# EAGLE design 2020-02-LPD3806-orig (EAGLE 9.5.1)
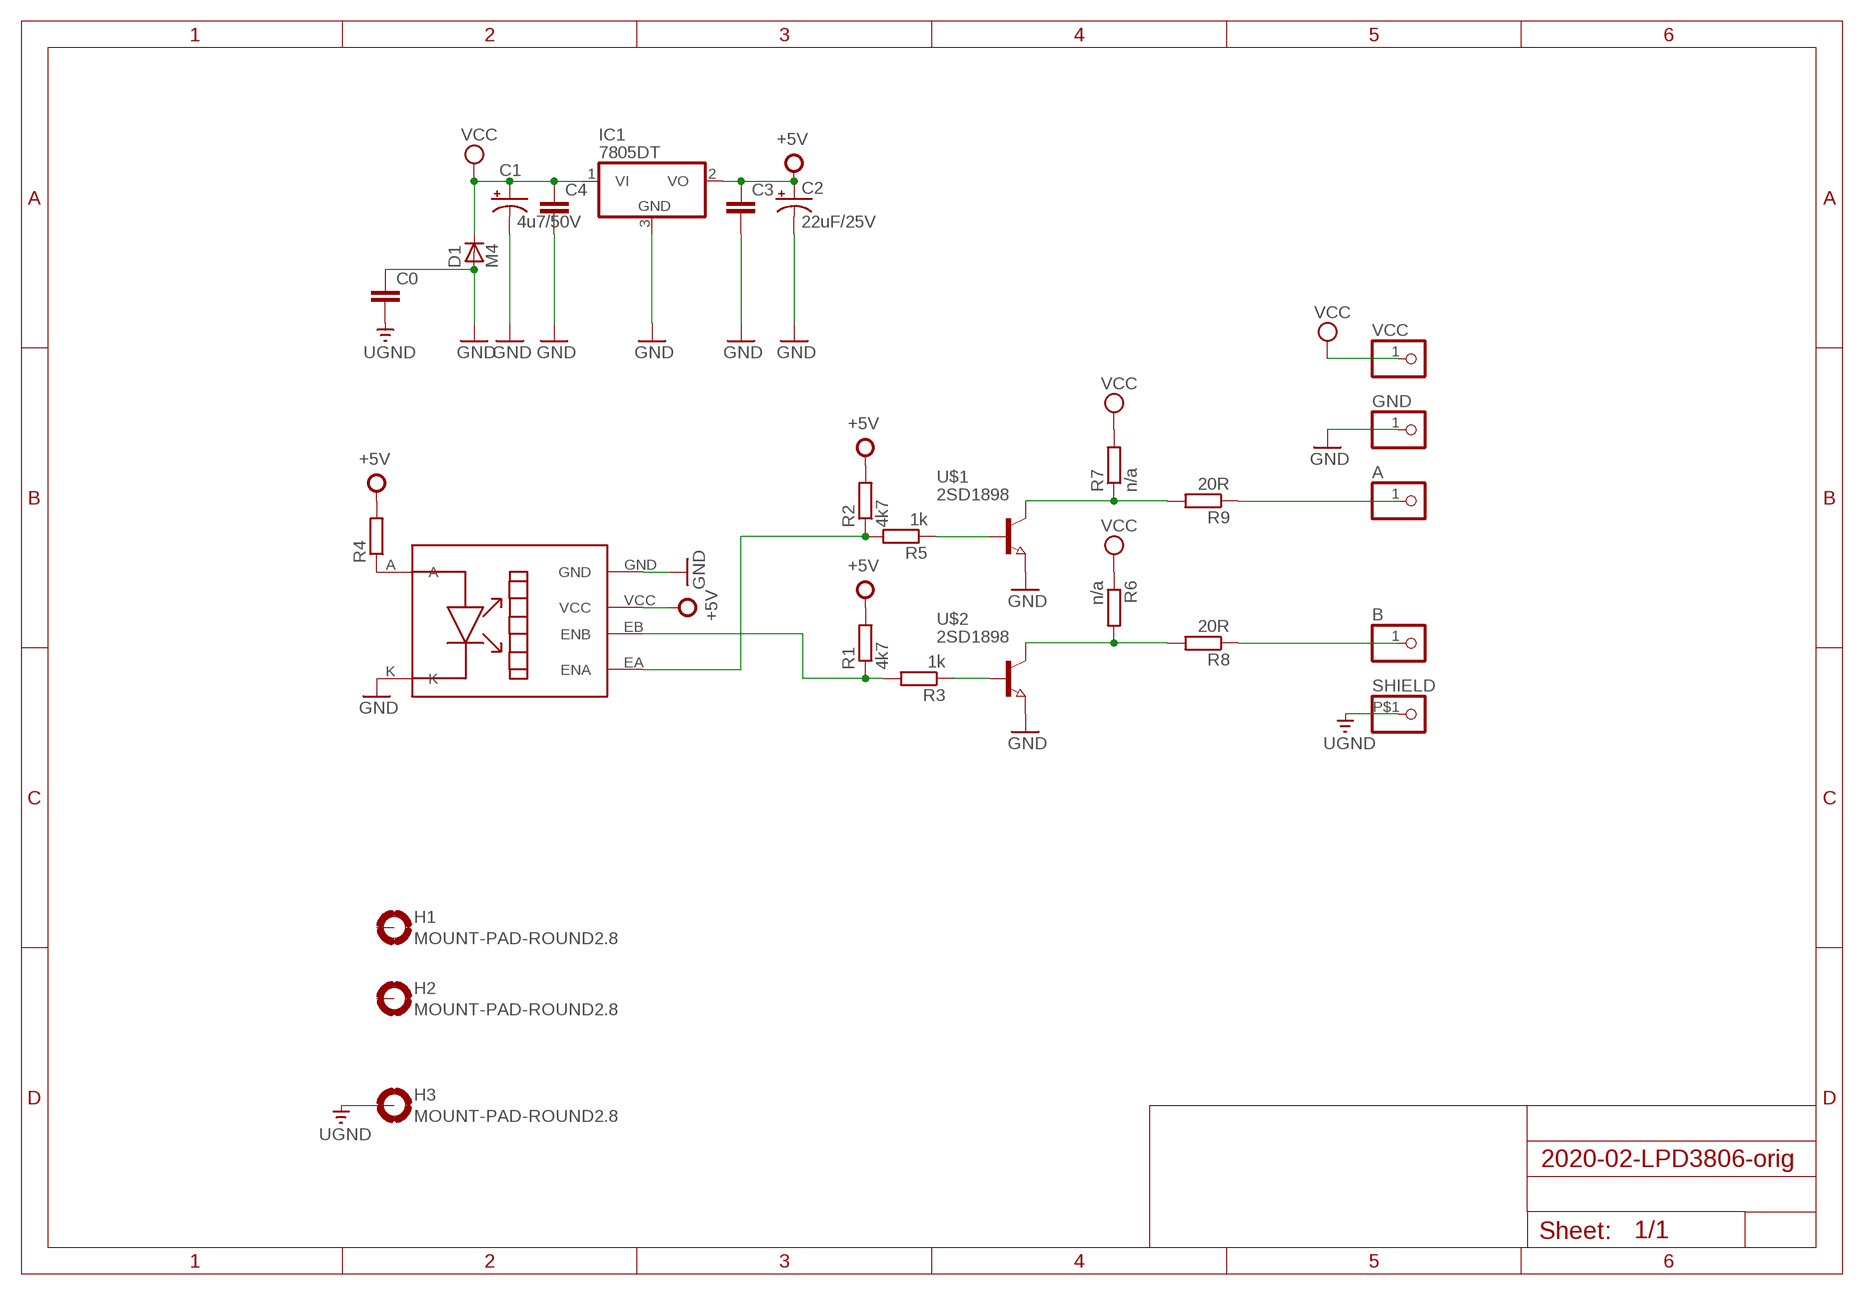
[diagram p0: schematic, sheet 1]

## Parts
A  PINHD-1X1  [1X01]
B  PINHD-1X1  [1X01]
C0  C-EUC1206  [C1206]
C1  4u7/50V  CPOL-US153CLV-0405  [153CLV-0405]
C2  22uF/25V  CPOL-US153CLV-0505  [153CLV-0505]
C3  C-EUC0805  [C0805]
C4  C-EUC0805  [C0805]
D1  M4  DIODESOD-123  [SOD-123]
GND  PINHD-1X1  [1X01]
H1  MOUNT-PAD-ROUND2.8  [2,8-PAD]
H2  MOUNT-PAD-ROUND2.8  [2,8-PAD]
H3  MOUNT-PAD-ROUND2.8  [2,8-PAD]
IC1  7805DT  [TO252]
R1  4k7  R-EU_R0805  [R0805]
R2  4k7  R-EU_R0805  [R0805]
R3  1k  R-EU_R0805  [R0805]
R4  R-EU_R1206  [R1206]
R5  1k  R-EU_R0805  [R0805]
R6  n/a  R-EU_R1206  [R1206]
R7  n/a  R-EU_R1206  [R1206]
R8  20R  R-EU_R1206  [R1206]
R9  20R  R-EU_R1206  [R1206]
SHIELD  PINHD-1X1-BIGPOGO  [1X1-BIGPOGO]
U$1  2SD1898  [SOT-89]
U$2  2SD1898  [SOT-89]
U$3  N30-6841  [N30-6841]
VCC  PINHD-1X1  [1X01]

## Nets
+5V: C2.+ C3.1 IC1.2(VO) R1.2 R2.2 R4.2 U$3.VCC
GND: C0.1 C1.- C2.- C3.2 C4.2 D1.A GND.1 IC1.3(GND) U$1.E U$2.E U$3.GND U$3.K
N$1: A.1 R9.1
N$2: R7.1 R9.2 U$1.C1(C) U$1.C2(C)
N$3: B.1 R8.1
N$4: R6.2 R8.2 U$2.C1(C) U$2.C2(C)
N$5: R4.1 U$3.A
N$6: R2.1 R5.2 U$3.EA(ENA)
N$7: R5.1 U$1.B
N$8: R1.1 R3.2 U$3.EB(ENB)
N$9: R3.1 U$2.B
UGND: C0.2 H3.B2,8(MOUNT) SHIELD.P$1
VCC: C1.+ C4.1 D1.C IC1.1(VI) R6.1 R7.2 VCC.1
Unconnected: H1.B2,8(MOUNT) H2.B2,8(MOUNT)

## Library data of the parts
A B GND SHIELD VCC = adafruit:PINHD-1X1: Pin header 1x1 for 0.1" spacing With round pins
C0 C3 C4 = rcl:C-EU: CAPACITOR, European symbol; SPICEPREFIX: C
C1 C2 = adafruit:CPOL-US: POLARIZED CAPACITOR, American symbol
D1 = adafruit:DIODE: Diode SMADIODE - SMA Surface Mount Package 20V 1A Schottky Diode Digikey: 641-1014-6-ND DO-1N4148 - Through Hole Small Current Diode SOD-123 20V 1 A (.5mV Vf) Schottky Diode - Digikey: MBRX120TPMSCT-ND SOD-323 10V 570mA (.38mV Vf, 3ns) Schottky Diode - Digikey: ZLLS410CT-ND SOD-523 30V 30mA Schottky Diode (RB751S-40TE61) - Digikey: RB751S-40TE61CT-ND SOT23-R/W - SOT23 Package (R = Solder Paste/Reflow Ovens, W = Hand-Soldering) BAT54Film 40V 300mA - Digikey: 497-7162-1-ND
H1-H3 = holes:MOUNT-PAD-ROUND: MOUNTING PAD, round
IC1 = linear4:78*: Positive VOLTAGE REGULATOR
R1-R9 = rcl:R-EU_: RESISTOR, European symbol; SPICEPREFIX: R
U$1 U$2 = 2SD1898:2SD1898
U$3 = N30-6841:N30-6841

## Board
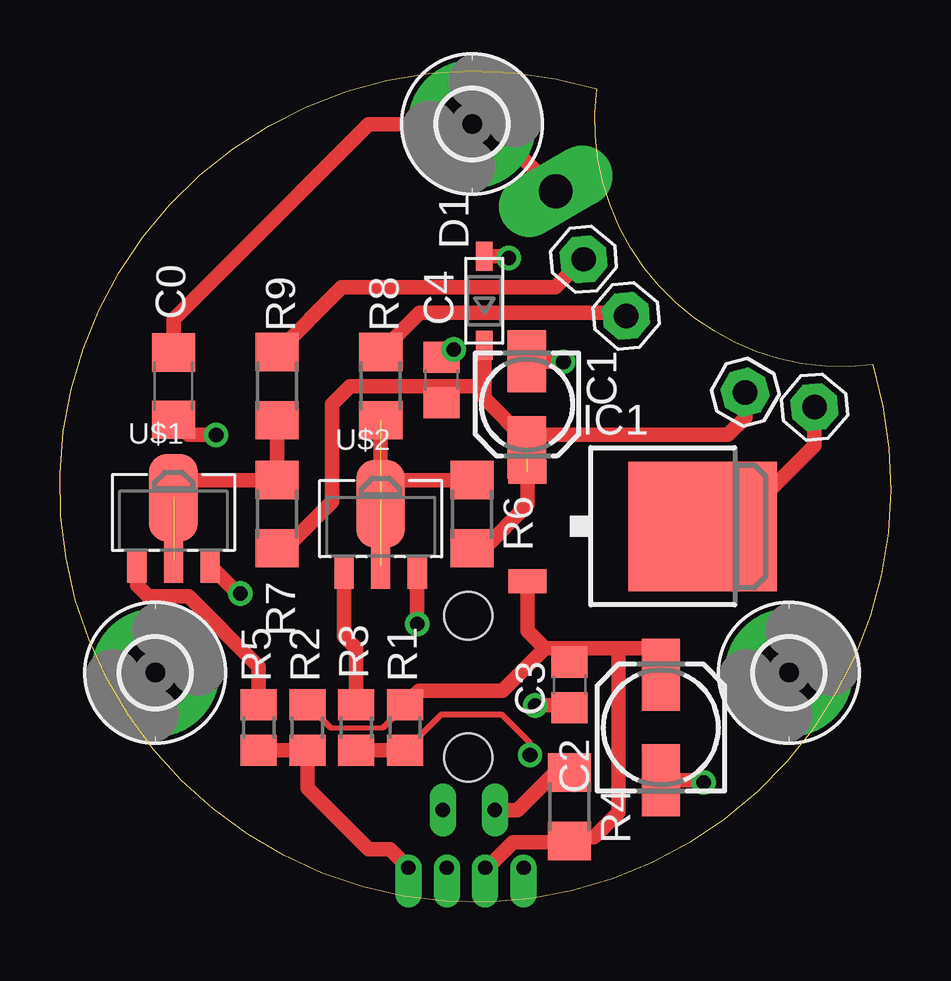
[diagram p1: board, top side]
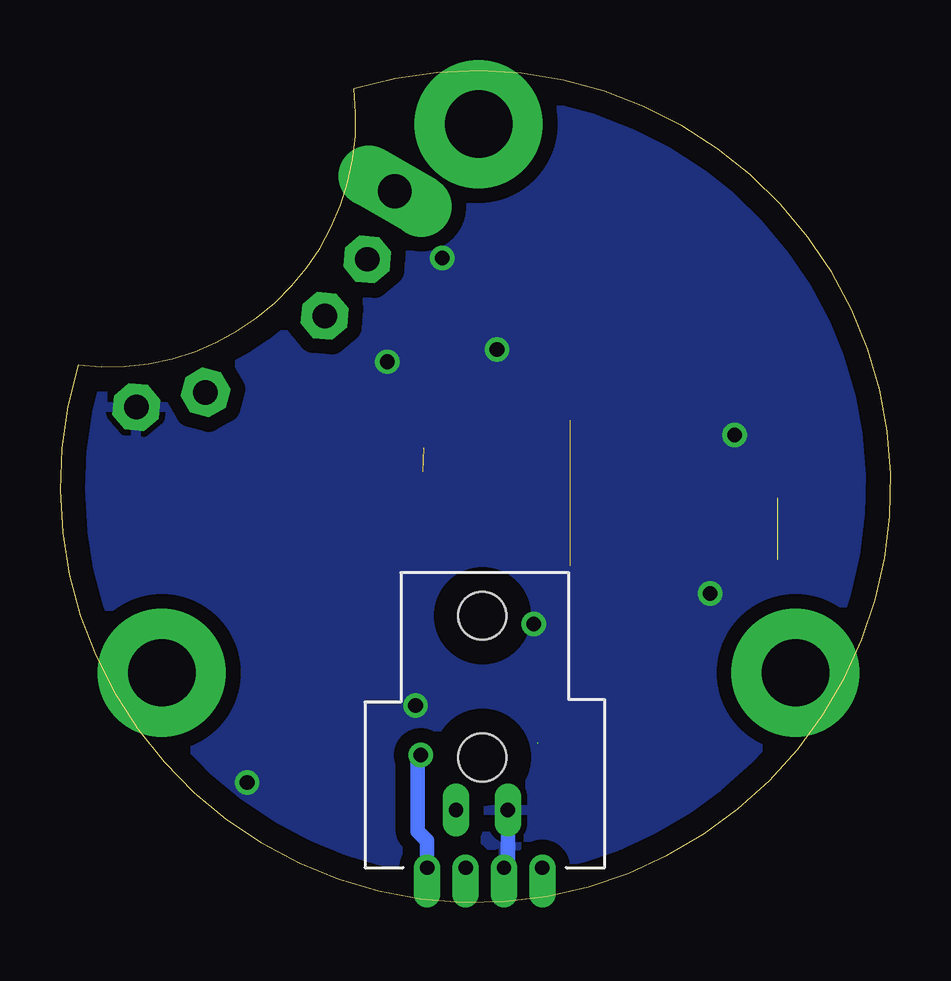
[diagram p2: board, bottom side, seen from below]

Size 34.64 x 34.64 mm. Coordinates in mm from the lower left corner, seen from the top.
Outline: 33.88,22.38 arc-104 22.38,33.88 arc304 33.88,22.38
Copper layers (1*16): Top 0.035mm / dielectric 1.5mm / Bottom 0.035mm
Design rules "default": minimum track width 10mil, minimum drill 24mil, track to track 8mil, track to pad 8mil, pad to pad 8mil, via to via 8mil, smd to smd 8mil, copper to edge 40mil, drill to drill 8mil, minimum pad ring 10mil, minimum via ring 8mil, stop-mask expansion 4mil, vias tented up to drill 0mil, thermal gap 10mil

### Footprints (pad centres in the part's own frame; a part is rotated, then mirrored left to right if it is on the bottom)
1X01 = drill 1.016 pad 1.93 octagon: 1 0,0
C1206 = smd 1.6 x 1.8: 1 -1.4,0; 2 1.4,0
153CLV-0405 = smd 2.6 x 1.6: + 1.8,0; - -1.8,0
153CLV-0505 = smd 3 x 1.6: + 2.2,0; - -2.2,0
C0805 = smd 1.3 x 1.5: 1 -0.95,0; 2 0.95,0
SOD-123 = smd 1.2 x 0.7: A 1.85,0; C -1.85,0
2,8-PAD = drill 2.8 pad 5.334: B2,8 0,0
TO252 = smd 1 x 1.6: 1 -2.28,-4.8; 2 2.28,-4.8 | smd 5.4 x 6.2: 3 0,2.5
R0805 = smd 1.3 x 1.5: 1 -0.95,0; 2 0.95,0
R1206 = smd 1.6 x 1.803: 1 -1.422,0; 2 1.422,0
1X1-BIGPOGO = drill 1.4 pad 2.54 long: P$1 0,0
SOT-89 = smd 0.8 x 1.4: B -1.524,-1.905; E 1.524,-1.905 | smd 0.8 x 1.9: C1 0,-1.651 | smd 2.032 x 3.65: C2 0,0.94
N30-6841 = drill 0.6 long: A 1.2,2.4; K -0.96,2.4 | drill 0.6 offset: EA -2.4,0; EB 2.4,0; GND -0.8,0; VCC 0.8,0 | hole 2: 0.1,4.6; 0.1,10.5

### Placement (x,y rotation side)
A  21.83,26.78 50 top
B  23.6,24.43 50 top
C0  4.73,21.5 90 top
C1  19.47,20.74 270 top
C2  25.05,7.27 90 top
C3  21.24,9.05 270 top
C4  15.91,21.75 90 top
D1  17.69,25.05 90 top
GND  31.45,20.62 230 top
H1  30.39,9.56 0 top
H2  3.97,9.56 0 top
H3  17.18,32.42 0 top
IC1  24.29,15.66 270 top
R1  14.39,7.27 90 top
R2  10.32,7.27 90 top
R3  12.35,7.27 270 top
R4  21.24,3.97 270 top
R5  8.29,7.27 270 top
R6  17.18,16.16 90 top
R7  9.05,16.16 270 top
R8  13.37,21.5 270 top
R9  9.05,21.5 270 top
SHIELD  20.67,29.62 30 top
U$1  4.73,15.91 0 top
U$2  13.37,15.66 0 top
U$3  16.93,1.43 0 top
VCC  28.57,21.24 240 top

### Tracks (layer width: path | path; a pad name or v marks a point on that pad's centre or on a via)
+5V
  Top 0.203: 11.27,7.27 13.47,7.27
  Top 0.254: R2.2 11.27,7.27 | 13.47,7.27 14.39,8.19 R1.2
  Top 0.61: IC1.2 19.49,11.31 20.23,10.58 | 20.23,10.58 21.24,10.58 | 21.24,10.58 23.28,10.58 | 23.28,10.58 24.8,10.58 25.05,10.32 C2.+ | U$3.VCC 17.82,1.43 18.89,2.49 21.19,2.49 R4.2 21.4,2.7 22.26,2.7 23.28,3.72 23.28,10.58 | R1.2 14.96,8.8 18.45,8.8 20.23,10.58 | C3.1 21.24,10.58
GND  (via drill 0.61)
  Top 0.61: C2.- 26.75,5.07 v26.83,4.99 | U$1.E 7.4,12.86 v7.53,12.86 | U$2.E v14.89,11.59 | C0.1 5.37,19.47 v6.51,19.47 | C1.- 19.49,22.51 v20.99,22.51 | D1.A 18.63,26.9 v18.7,26.83 | GND.1 31.45,19.01 29.37,16.93 28.06,16.93 IC1.3 27.3,15.15 27.34,15.15 | C4.2 16.23,23.02 v16.42,23.02 | C3.2 21.15,8.2 v19.81,8.2
  Bottom 0.61: U$3.GND 15.97,1.59 15.97,3.81 15.95,3.82
  pour Bottom (isolate 0.61): -1.36,35.47 -1.26,-0.09 35.47,-0.09 35.47,35.37 35.37,35.47
N$1
  Top 0.61: R9.1 11.74,25.61 20.66,25.61 A.1
N$2  (1 unrouted)
  Top 0.61: R9.2 R7.1 4.84,17.59 4.73,17.69 U$1.C2
N$3
  Top 0.61: R8.1 15,24.55 23.48,24.55 B.1
N$4  (2 unrouted)
  Top 0.61: R6.2 13.22,17.59 13.12,17.69 13.37,17.94 R8.2
N$5
  Top 0.61: U$3.A 19.07,3.83 20.63,5.39 R4.1
N$6
  Top 0.61: R5.2 R2.1 10.32,4.73 12.86,2.19 13.76,2.19 14.36,1.6 14.54,1.58 14.54,1.45 U$3.EA
N$7
  Top 0.61: U$1.B 3.21,13.21 3.68,12.73 5.37,12.73 8.29,9.81 R5.1
N$8  (via drill 0.61)  (1 unrouted)
  Top 0.254: v19.59,6.13 19.59,6.64 18.43,7.8 15.89,7.8 14.7,6.61
  Top 0.61: R3.2 R1.1 14.7,6.64
  Bottom 0.61: U$3.EB 19.33,2.56 19.72,2.96 19.72,5.75 19.47,6 v19.59,6.13
N$9
  Top 0.61: U$2.B 11.85,11.08 12.35,10.58 R3.1
UGND
  Top 0.61: C0.2 4.73,24.29 12.86,32.42 H3.B2,8 17.87,32.42 SHIELD.P$1
VCC  (1 unrouted)
  Top 0.61: VCC.1 28.57,20.18 27.85,19.47 19.99,19.47 19.49,18.96 | 19.49,18.96 IC1.1 19.49,16.55 17.69,14.74 R6.1 | R7.2 9.41,14.74 11.34,16.67 11.34,20.74 12.1,21.5 15.91,21.5 | D1.C 17.69,21.5 | 17.69,21.5 17.69,20.99 19.49,19.19 19.49,18.96 | 15.91,21.5 17.69,21.5 | C4.1 15.91,21.5